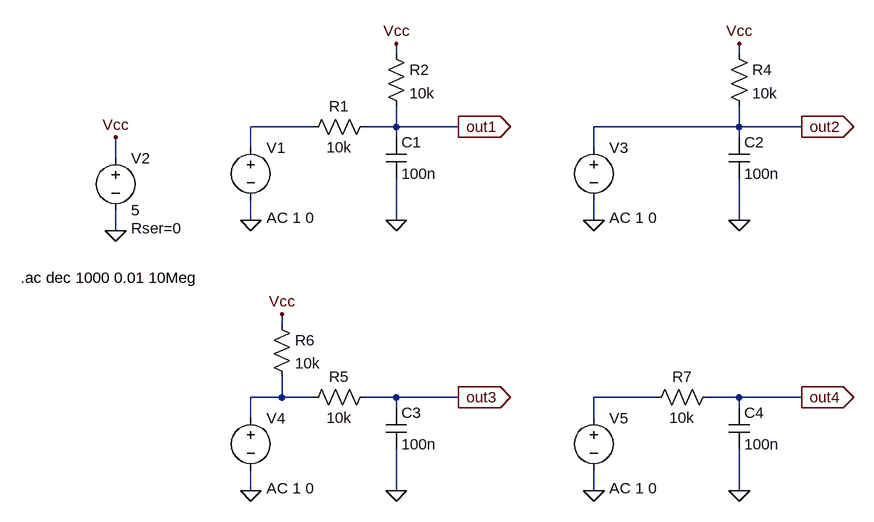
[diagram p0: schematic Draft1.asc]
Draft1.asc, the LTspice schematic file:
Version 4
SHEET 1 972 728
WIRE 240 16 240 0
WIRE 768 16 768 0
WIRE 112 128 16 128
WIRE 240 128 240 96
WIRE 240 128 192 128
WIRE 336 128 240 128
WIRE 768 128 768 96
WIRE 768 128 544 128
WIRE 864 128 768 128
WIRE 240 144 240 128
WIRE 768 144 768 128
WIRE 16 160 16 128
WIRE 544 160 544 128
WIRE -192 176 -192 144
WIRE 16 272 16 240
WIRE 240 272 240 208
WIRE 544 272 544 240
WIRE 768 272 768 208
WIRE -192 288 -192 256
WIRE 64 432 64 416
WIRE 64 544 64 512
WIRE 64 544 16 544
WIRE 112 544 64 544
WIRE 240 544 192 544
WIRE 336 544 240 544
WIRE 640 544 544 544
WIRE 768 544 720 544
WIRE 864 544 768 544
WIRE 240 560 240 544
WIRE 768 560 768 544
WIRE 16 576 16 544
WIRE 544 576 544 544
WIRE 16 688 16 656
WIRE 240 688 240 624
WIRE 544 688 544 656
WIRE 768 688 768 624
FLAG 16 272 0
FLAG 240 272 0
FLAG -192 288 0
FLAG -192 144 Vcc
FLAG 240 0 Vcc
FLAG 336 128 out1
IOPIN 336 128 Out
FLAG 544 272 0
FLAG 768 272 0
FLAG 768 0 Vcc
FLAG 864 128 out2
IOPIN 864 128 Out
FLAG 16 688 0
FLAG 240 688 0
FLAG 64 416 Vcc
FLAG 336 544 out3
IOPIN 336 544 Out
FLAG 544 688 0
FLAG 768 688 0
FLAG 864 544 out4
IOPIN 864 544 Out
SYMBOL voltage 16 144 R0
WINDOW 123 24 124 Left 2
WINDOW 39 0 0 Left 0
SYMATTR InstName V1
SYMATTR Value ""
SYMATTR Value2 AC 1 0
SYMBOL cap 224 144 R0
SYMATTR InstName C1
SYMATTR Value 100n
SYMBOL res 208 112 R90
WINDOW 0 0 56 VBottom 2
WINDOW 3 32 56 VTop 2
SYMATTR InstName R1
SYMATTR Value 10k
SYMBOL res 224 0 R0
SYMATTR InstName R2
SYMATTR Value 10k
SYMBOL voltage -192 160 R0
WINDOW 123 0 0 Left 0
WINDOW 39 24 124 Left 2
SYMATTR InstName V2
SYMATTR Value 5
SYMATTR SpiceLine Rser=0
SYMBOL voltage 544 144 R0
WINDOW 123 24 124 Left 2
WINDOW 39 0 0 Left 0
SYMATTR InstName V3
SYMATTR Value ""
SYMATTR Value2 AC 1 0
SYMBOL cap 752 144 R0
SYMATTR InstName C2
SYMATTR Value 100n
SYMBOL res 752 0 R0
SYMATTR InstName R4
SYMATTR Value 10k
SYMBOL voltage 16 560 R0
WINDOW 123 24 124 Left 2
WINDOW 39 0 0 Left 0
SYMATTR InstName V4
SYMATTR Value ""
SYMATTR Value2 AC 1 0
SYMBOL cap 224 560 R0
SYMATTR InstName C3
SYMATTR Value 100n
SYMBOL res 208 528 R90
WINDOW 0 0 56 VBottom 2
WINDOW 3 32 56 VTop 2
SYMATTR InstName R5
SYMATTR Value 10k
SYMBOL res 48 416 R0
SYMATTR InstName R6
SYMATTR Value 10k
SYMBOL voltage 544 560 R0
WINDOW 123 24 124 Left 2
WINDOW 39 0 0 Left 0
SYMATTR InstName V5
SYMATTR Value ""
SYMATTR Value2 AC 1 0
SYMBOL cap 752 560 R0
SYMATTR InstName C4
SYMATTR Value 100n
SYMBOL res 736 528 R90
WINDOW 0 0 56 VBottom 2
WINDOW 3 32 56 VTop 2
SYMATTR InstName R7
SYMATTR Value 10k
TEXT -338 360 Left 2 !.ac dec 1000 0.01 10Meg

The netlist it stands for:
* Draft1.asc
V1 N001 0 AC 1 0
C1 out1 0 100n
R1 out1 N001 10k
R2 Vcc out1 10k
V2 Vcc 0 5 Rser=0
V3 out2 0 AC 1 0
C2 out2 0 100n
R4 Vcc out2 10k
V4 N002 0 AC 1 0
C3 out3 0 100n
R5 out3 N002 10k
R6 Vcc N002 10k
V5 N003 0 AC 1 0
C4 out4 0 100n
R7 out4 N003 10k
.ac dec 1000 0.01 10Meg
.backanno
.end